# EasyEDA Pro project slimarm_apricot.eprj, schematic Schematic1
Create Date: 2023-05-16; Page Name: P1; Project Name: slimarm_apricot_dev; Schematic Name: Schematic1; Update Date: 2023-05-26; Company: jlywxy; Drawed: jlywxy; Page Size: A4; Part Number: Apricot; Reviewed: jlywxy; Version: V1.0
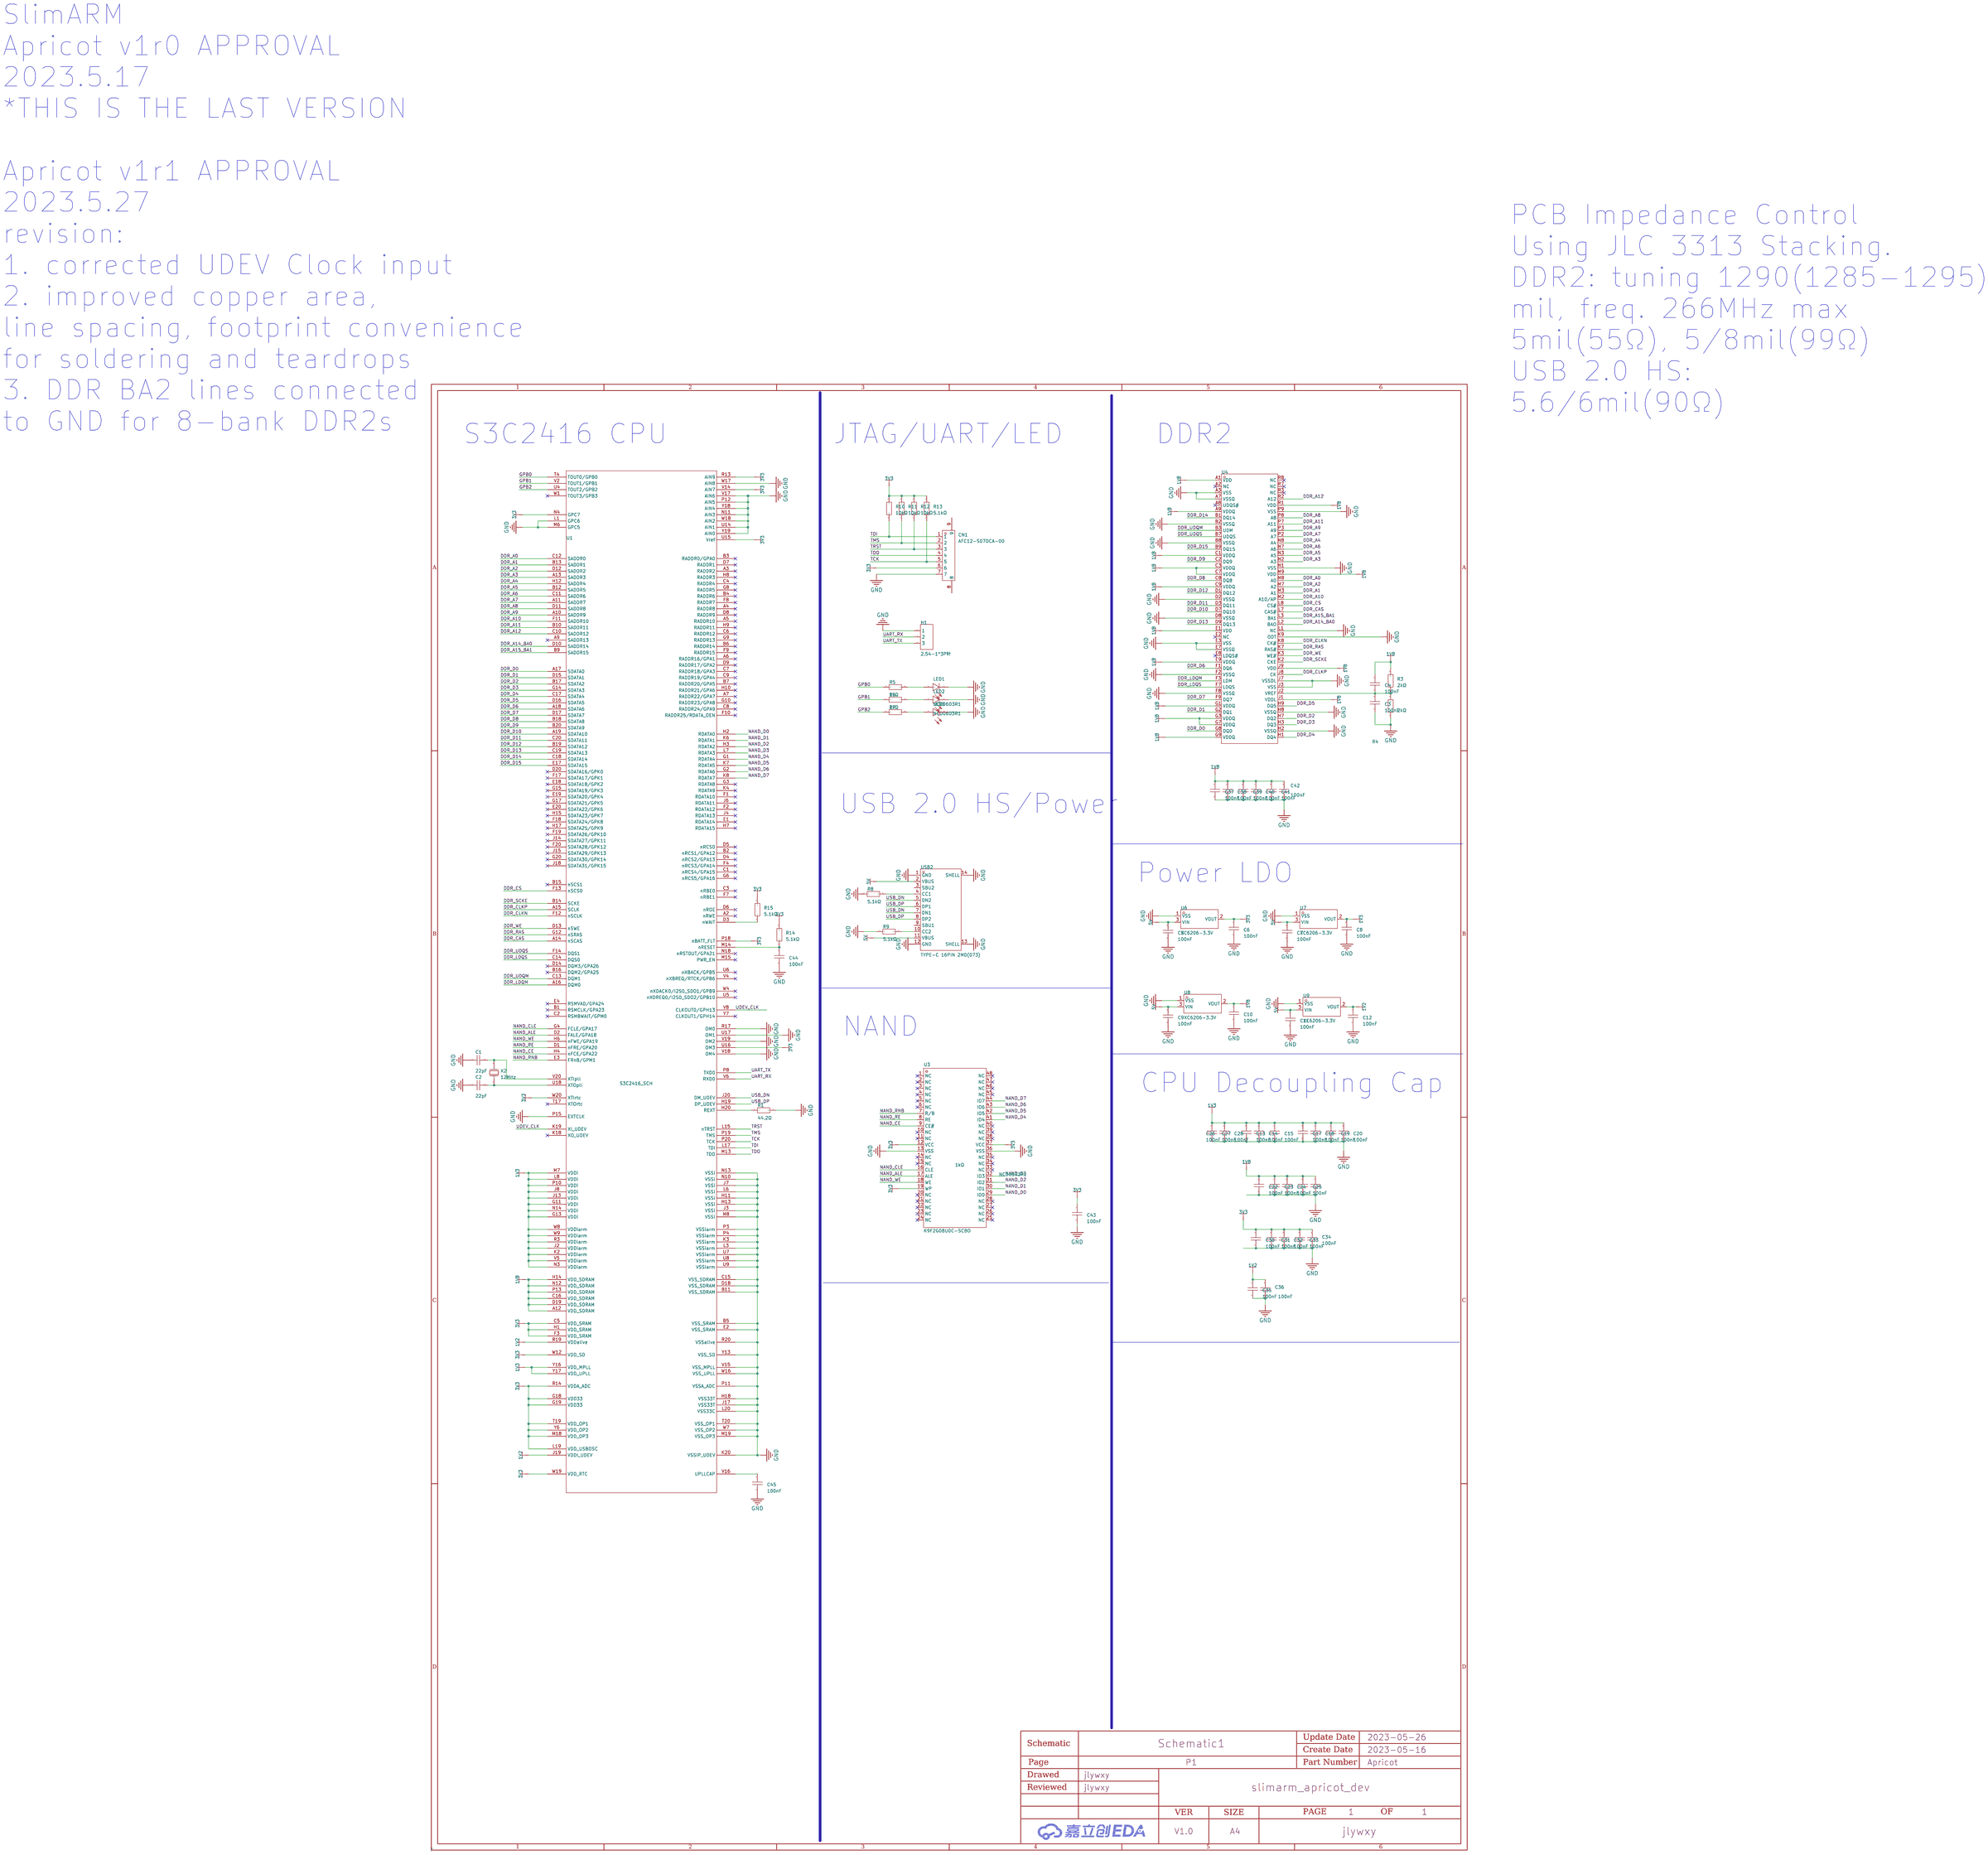
[diagram p0: schematic sheet]

## Parts
C1  22pF  [C0402]
C2  22pF  [C0402]
C3  100nF  [C0402]
C4  100nF  [C0402]
C5  100nF  [C0402]
C6  100nF  [C0402]
C7  100nF  [C0402]
C8  100nF  [C0402]
C9  100nF  [C0402]
C10  100nF  [C0402]
C11  100nF  [C0402]
C12  100nF  [C0402]
C13  100nF  [C0402]
C14  100nF  [C0402]
C15  100nF  [C0402]
C17  100nF  [C0402]
C18  100nF  [C0402]
C19  100nF  [C0402]
C20  100nF  [C0402]
C22  100nF  [C0402]
C23  100nF  [C0402]
C24  100nF  [C0402]
C25  100nF  [C0402]
C26  100nF  [C0402]
C27  100nF  [C0402]
C28  100nF  [C0402]
C30  100nF  [C0402]
C31  100nF  [C0402]
C32  100nF  [C0402]
C33  100nF  [C0402]
C34  100nF  [C0402]
C35  100nF  [C0402]
C36  100nF  [C0402]
C37  100nF  [C0402]
C38  100nF  [C0402]
C39  100nF  [C0402]
C40  100nF  [C0402]
C41  100nF  [C0402]
C42  100nF  [C0402]
C43  100nF  [C0402]
C44  100nF  [C0402]
C45  100nF  [C0402]
CN1  AFC12-S07DCA-00  [CONN-SMD_AFC12-S07DCA-00]
H1  2.54-1*3P针  [HDR-TH_3P-P2.54-V-M-1]
LED1  NCD0603R1  [LED0603-RD_RED]
LED2  NCD0603R1  [LED0603-RD_RED]
LED3  NCD0603R1  [LED0603-RD_RED]
R1  44.2Ω  [R0603]
R3  2kΩ  [R0603]
R4  2kΩ  [R0603]
R5  1kΩ  [R0603]
R6  1kΩ  [R0603]
R7  1kΩ  [R0603]
R8  5.1kΩ  [R0402]
R9  5.1kΩ  [R0402]
R10  10kΩ  [R0402]
R11  10kΩ  [R0402]
R12  10kΩ  [R0402]
R13  5.1kΩ  [R0402]
R14  5.1kΩ  [R0402]
R15  5.1kΩ  [R0402]
U1  S3C2416_SCH  [S3C2416-XH40]
U3  K9F2G08U0C-SCBO  [TSOP-48_L12.0-W18.4-P0.50-LS20.0-BL]
U4  NT5TU32M16FG-AC  [VFBGA-84_L7.5-W12.2-P0.80-TL_NANYA_NT5TU32M16FG]
U6  XC6206-3.3V  [SSOT-3_L2.9-W1.6-P0.95-LS2.8-BR]
U7  XC6206-3.3V  [SSOT-3_L2.9-W1.6-P0.95-LS2.8-BR]
U8  XC6206-3.3V  [SSOT-3_L2.9-W1.6-P0.95-LS2.8-BR]
U9  XC6206-3.3V  [SSOT-3_L2.9-W1.6-P0.95-LS2.8-BR]
USB2  TYPE-C 16PIN 2MD(073)  [USB-C-SMD_TYPE-C-6PIN-2MD-073]
X2  12MHz  [CRYSTAL-SMD_L5.0-W3.2]

## Library data of the parts
C1-C15 C17-C20 C22-C28 C30-C45 = CC0402JRNPO9BN220: 容值:22pF;精度:±5%;额定电压:50V;材质(温度系数):NP0;; LCSC Part Name: 22pF ±5% 50V; Supplier Part: C106203; Manufacturer: YAGEO(国巨); Supplier Footprint: 0402; JLCPCB Part Class: Extended Part; Datasheet: https://atta.szlcsc.com/upload/public/pdf/source/20170425/1493115775511.pdf; Supplier: LCSC; Tolerance: ±5%; Voltage Rated: 50V; Temperature Coefficient: NP0
CN1 = AFC12-S07DCA-00: 参考系列:-;间距:1.25mm;插针结构:1x7P;排数:1;每排PIN数:7;行距:-;公母:公型插针;安装方式:卧贴;额定电流:1A;工作温度范围:-20℃~+85℃;; LCSC Part Name: 1.25mm 1x7P 卧贴; Supplier Part: C561394; Manufacturer: JS(钜硕电子); Supplier Footprint: SMD,P=1.25mm; JLCPCB Part Class: Extended Part; Datasheet: https://atta.szlcsc.com/upload/public/pdf/source/20191211/C466543_1944CC24B799268ED4D26E9C7CC66BEC.pdf; Supplier: LCSC; Pitch: 1.25mm; Pins Structure: 1x7P; Number of Rows: 1; Number of PINs Per Row: 7; Gender: 公型插针; Mounting Style: 卧贴; Current Rating (Max): 1A; Operating Temperature Range: -20℃~+85℃
H1 = 2.54-1*3P针: 排数:单排;总PIN位数:3;间距:2.54mm;插针结构:1x3P;行距:-;安装类型:直插;圆针/方针:方针;额定电流:3A;额定电压:-;配合针长度:-;塑高:-;端接针长度:-;触头材质:-;触头镀层:-;工作温度范围:-40℃~+105℃;颜色:黑色;; LCSC Part Name: 2.54mm 1x3P 直插 方针; Supplier Part: C49257; Manufacturer: BOOMELE(博穆精密); Supplier Footprint: 插件,P=2.54mm; JLCPCB Part Class: Extended Part; Datasheet: https://atta.szlcsc.com/upload/public/pdf/source/20221018/3E9408392E35E6F57A28985E5F7BF5C9.pdf; Supplier: LCSC; Number of Rows: 单排; Number of Pins: 3; Pitch: 2.54mm; Pin Structure: 1x3P; Mounting Type: 直插; Circluar Pins/Square Pins: 方针; Current Rating (Max): 3A; Operating Temperature Range: -40℃~+105℃; Color: 黑色
LED1-LED3 = NCD0603R1_C84263: 发光颜色:红灯;; LCSC Part Name: 红灯; Supplier Part: C84263; Manufacturer: 国星光电; Supplier Footprint: 0603; JLCPCB Part Class: Extended Part; Datasheet: https://atta.szlcsc.com/upload/public/pdf/source/20200820/C84263_DABC6A75E58F576973B407FDBA283D60.pdf; Supplier: LCSC; Emitted Color: 红灯
R1 R3 R4 = RCT0244R2FLF: 阻值:44.2Ω;精度:±1%;功率:62.5mW;; LCSC Part Name: 44.2Ω ±1% 62.5mW; Supplier Part: C173939; Manufacturer: HKR; Supplier Footprint: 0402; JLCPCB Part Class: Extended Part; Datasheet: https://atta.szlcsc.com/upload/public/pdf/source/20180228/C173939_15197985674981376031.pdf; Supplier: LCSC; Tolerance: ±1%; Power(Watts): 62.5mW
R5-R7 = 0603WAF1001T5E: 电阻类型:厚膜电阻;阻值:1kΩ;精度:±1%;功率:100mW;; LCSC Part Name: 1kΩ ±1% 100mW; Supplier Part: C21190; Manufacturer: UNI-ROYAL(厚声); Supplier Footprint: 0603; JLCPCB Part Class: Basic Part; Datasheet: https://atta.szlcsc.com/upload/public/pdf/source/20200306/C422600_1E6D84923E4A46A82E41ADD87F860B5C.pdf; Supplier: LCSC; Type: 厚膜电阻; Tolerance: ±1%; Power(Watts): 100mW; Temperature Coefficient: ±100ppm/℃; Overload Voltage (Max): 75V; Operating Temperature Range: -55℃~+155℃
R8-R15 = 0402WGF5101TCE: 电阻类型:厚膜电阻;阻值:5.1kΩ;精度:±1%;功率:62.5mW;; LCSC Part Name: 5.1kΩ ±1% 62.5mW; Supplier Part: C25905; Manufacturer: UNI-ROYAL(厚声); Supplier Footprint: 0402; JLCPCB Part Class: Basic Part; Datasheet: https://atta.szlcsc.com/upload/public/pdf/source/20200306/C422600_1E6D84923E4A46A82E41ADD87F860B5C.pdf; Supplier: LCSC; Type: 厚膜电阻; Tolerance: ±1%; Power(Watts): 62.5mW; Temperature Coefficient: ±100ppm/℃; Overload Voltage (Max): 50V; Operating Temperature Range: -55℃~+155℃
U1 = S3C2416_SCH
U3 = K9F2G08U0C-SCBO: 存储器构架(格式):FLASH;存储器接口类型:Parallel;存储器容量:2Gb (256M x 8);存储器类型:Non-Volatile;; Supplier Part: C40316; Supplier Footprint: TSOP-48; JLCPCB Part Class: Extended Part; Datasheet: https://atta.szlcsc.com/upload/public/pdf/source/20150922/1457707410697.pdf; Supplier: LCSC
U4 = NT5TU32M16FG-AC: Supplier Part: C2903553; Manufacturer: Nanya(南亚科技); Supplier Footprint: BGA; JLCPCB Part Class: Extended Part; Supplier: LCSC
U6-U9 = XC6206-3.3V: 输出类型:固定;输出极性:正;最大输入电压:6V;输出电压:3.3V;输出电流:250mA;; Supplier Part: C2891841; Manufacturer: YONGYUTAI(永裕泰); Supplier Footprint: SOT-23-3L; JLCPCB Part Class: Extended Part; Datasheet: https://atta.szlcsc.com/upload/public/pdf/source/20210901/DE3C77F0CE73FFE8F7C655BE9B94CB06.pdf; Supplier: LCSC; Output Type: 固定; Output Polarity: 正; Number of Outputs: 1; Maximum Input Voltage: 6V; Output Voltage: 3.3V; Output Current: 250mA; Operating Temperature: -40℃~+85℃
USB2 = TYPE-C 16PIN 2MD(073): 连接器类型:Type-C;标准:-;公母:母座;触点数量:16;端口数量:1;安装方式:卧贴;额定电流 - 电源:5A;工作温度范围:-25℃~+85℃;; LCSC Part Name: TYPE-C母座 16P 4脚插件带定位柱 不锈钢外壳 2次模顶; Supplier Part: C2765186; Manufacturer: SHOU HAN(首韩); Supplier Footprint: SMD; JLCPCB Part Class: Extended Part; Datasheet: https://atta.szlcsc.com/upload/public/pdf/source/20211123/39B17C16241EAC15C5E277BDA434118E.pdf; Supplier: LCSC; Connector Type: Type-C; Gender: 母座; Number of Contacts: 16; Number of Ports: 1; Mounting Style: 卧贴; Current Rating - Power (Max): 5A; Operating Temperature Range: -25℃~+85℃
X2 = X50328MSB2GI: 频率:8MHz;频率公差:±10ppm;负载电容:20pF;; LCSC Part Name: 8MHz ±10ppm 20pF YSX530GA; Supplier Part: C115962; Manufacturer: YXC(扬兴晶振); Supplier Footprint: SMD5032-2P; JLCPCB Part Class: Basic Part; Datasheet: https://atta.szlcsc.com/upload/public/pdf/source/20230220/0EBFFB9D6D8CE6A211407822BBB6C516.pdf; Supplier: LCSC; Crystal Type: 贴片无源晶振; Frequency Tolerance: ±10ppm; Frequency Stability: ±50ppm; Load Capacitance: 20pF; Operating Temperature: -40℃~+85℃

## Nets
1V2: C12.1 C35.1 C36.1 U1.J19(VDDI_UDEV) U1.R19(VDDalive) U9.2(VOUT)
1V3: C8.1 C13.1 C14.1 C15.1 C17.1 C18.1 C19.1 C20.1 C27.1 C28.1 U1.G11(VDDi) U1.G13(VDDi) U1.J2(VDDiarm) U1.J8(VDDi) U1.J13(VDDi) U1.K2(VDDiarm) U1.L8(VDDi) U1.M7(VDDi) U1.N3(VDDiarm) U1.N14(VDDi) U1.P10(VDDi) U1.R3(VDDiarm) U1.V5(VDDiarm) U1.W8(VDDiarm) U1.W9(VDDiarm) U1.Y16(VDD_MPLL) U1.Y17(VDD_UPLL) U7.2(VOUT)
1V8: C4.1 C10.1 C22.1 C23.1 C24.1 C25.1 C26.1 C37.1 C38.1 C39.1 C40.1 C41.1 C42.1 R3.2 U1.A12(VDD_SDRAM) U1.C16(VDD_SDRAM) U1.D19(VDD_SDRAM) U1.H14(VDD_SDRAM) U1.N12(VDD_SDRAM) U1.P13(VDD_SDRAM) U4.A1(VDD) U4.A9(VDDQ) U4.C1(VDDQ) U4.C3(VDDQ) U4.C7(VDDQ) U4.C9(VDDQ) U4.E1(VDD) U4.E9(VDDQ) U4.G1(VDDQ) U4.G3(VDDQ) U4.G7(VDDQ) U4.G9(VDDQ) U4.J1(VDDL) U4.J9(VDD) U4.M9(VDD) U4.R1(VDD) U8.2(VOUT)
3V3: C6.1 C30.1 C31.1 C32.1 C33.1 C34.1 C43.1 CN1.6 R10.2 R11.2 R12.2 R13.2 R14.2 R15.2 U1.C5(VDD_SRAM) U1.F3(VDD_SRAM) U1.G18(VDD33) U1.G19(VDD33) U1.H1(VDD_SRAM) U1.L19(VDD_USBOSC) U1.M18(VDD_OP3) U1.N4(GPC7) U1.P18(nBATT_FLT) U1.R13(AIN9) U1.R14(VDDA_ADC) U1.T19(VDD_OP1) U1.U15(Vref) U1.U16(OM3) U1.V14(AIN7) U1.W12(VDD_SD) U1.W19(VDD_RTC) U1.W20(XTIrtc) U1.Y6(VDD_OP2) U3.12(VCC) U3.19(WP) U3.37(VCC) U6.2(VOUT)
5V: C5.1 C7.1 C9.1 C11.1 U6.3(VIN) U7.3(VIN) U8.3(VIN) U9.3(VIN) USB2.2(VBUS) USB2.11(VBUS)
GND: C1.1 C2.1 C3.1 C5.2 C6.2 C7.2 C8.2 C9.2 C10.2 C11.2 C12.2 C13.2 C14.2 C15.2 C17.2 C18.2 C19.2 C20.2 C22.2 C23.2 C24.2 C25.2 C26.2 C27.2 C28.2 C30.2 C31.2 C32.2 C33.2 C34.2 C35.2 C36.2 C37.2 C38.2 C39.2 C40.2 C41.2 C42.2 C43.2 C44.2 C45.2 CN1.7 H1.1 LED1.1(K) LED2.1(K) LED3.1(K) R1.2 R4.1 R8.1 R9.1 U1.B5(VSS_SRAM) U1.B11(VSS_SDRAM) U1.C15(VSS_SDRAM) U1.D18(VSS_SDRAM) U1.E2(VSS_SRAM) U1.H11(VSSi) U1.H13(VSSi) U1.H18(VSS33T) U1.J3(VSSi) U1.J7(VSSi) U1.J17(VSS33T) U1.K3(VSSiarm) U1.K20(VSSIP_UDEV) U1.L1(GPC6) U1.L3(VSSiarm) U1.L6(VSSi) U1.L20(VSS33C) U1.M6(GPC5) U1.M8(VSSi) U1.M19(VSS_OP3) U1.N10(VSSi) U1.N11(AIN3) U1.N13(VSSi) U1.P3(VSSiarm) U1.P4(VSSiarm) U1.P11(VSSA_ADC) U1.P12(AIN5) U1.P15(EXTCLK) U1.R17(OM0) U1.R20(VSSalive) U1.T20(VSS_OP1) U1.U7(VSSiarm) U1.U8(VSSiarm) U1.U9(VSSiarm) U1.U14(AIN1) U1.U17(OM1) U1.V15(VSS_MPLL) U1.V17(AIN6) U1.V18(OM4) U1.V19(OM2) U1.W7(VSS_OP2) U1.W16(VSS_UPLL) U1.W17(AIN8) U1.W18(AIN2) U1.Y13(VSS_SD) U1.Y18(AIN4) U1.Y19(AIN0) U3.13(VSS) U3.36(VSS) U4.A3(VSS) U4.A7(VSSQ) U4.B2(VSSQ) U4.B8(VSSQ) U4.D2(VSSQ) U4.D8(VSSQ) U4.E3(VSS) U4.E7(VSSQ) U4.F2(VSSQ) U4.F8(VSSQ) U4.H2(VSSQ) U4.H8(VSSQ) U4.J3(VSS) U4.J7(VSSDL) U4.K9(ODT) U4.L1(NC) U4.N1(VSS) U4.P9(VSS) U6.1(VSS) U7.1(VSS) U8.1(VSS) U9.1(VSS) USB2.1(GND) USB2.12(GND) USB2.13(SHELL) USB2.14(SHELL)
DDR_A0: U1.C12(SADDR0) U4.M8(A0)
DDR_A1: U1.B13(SADDR1) U4.M3(A1)
DDR_A2: U1.D12(SADDR2) U4.M7(A2)
DDR_A3: U1.A13(SADDR3) U4.N2(A3)
DDR_A4: U1.H12(SADDR4) U4.N8(A4)
DDR_A5: U1.B12(SADDR5) U4.N3(A5)
DDR_A6: U1.C11(SADDR6) U4.N7(A6)
DDR_A7: U1.A11(SADDR7) U4.P2(A7)
DDR_A8: U1.D11(SADDR8) U4.P8(A8)
DDR_A9: U1.A10(SADDR9) U4.P3(A9)
DDR_A10: U1.F11(SADDR10) U4.M2(A10/AP)
DDR_A11: U1.B10(SADDR11) U4.P7(A11)
DDR_A12: U1.C10(SADDR12) U4.R2(A12)
DDR_A14_BA0: U1.D10(SADDR14) U4.L2(BAO)
DDR_A15_BA1: U1.B9(SADDR15) U4.L3(BA1)
DDR_CAS: U1.A14(nSCAS) U4.L7(CAS#)
DDR_CLKN: U1.F12(nSCLK) U4.K8(CK#)
DDR_CLKP: U1.A15(SCLK) U4.J8(CK)
DDR_CS: U1.F13(nSCS0) U4.L8(CS#)
DDR_D0: U1.A17(SDATA0) U4.G8(DQ0)
DDR_D1: U1.D15(SDATA1) U4.G2(DQ1)
DDR_D2: U1.B17(SDATA2) U4.H7(DQ2)
DDR_D3: U1.G14(SDATA3) U4.H3(DQ3)
DDR_D4: U1.C17(SDATA4) U4.H1(DQ4)
DDR_D5: U1.D16(SDATA5) U4.H9(DQ5)
DDR_D6: U1.A18(SDATA6) U4.F1(DQ6)
DDR_D7: U1.D17(SDATA7) U4.F9(DQ7)
DDR_D8: U1.B18(SDATA8) U4.C8(DQ8)
DDR_D9: U1.B20(SDATA9) U4.C2(DQ9)
DDR_D10: U1.A19(SDATA10) U4.D7(DQ10)
DDR_D11: U1.C20(SDATA11) U4.D3(DQ11)
DDR_D12: U1.B19(SDATA12) U4.D1(DQ12)
DDR_D13: U1.C19(SDATA13) U4.D9(DQ13)
DDR_D14: U1.C18(SDATA14) U4.B1(DQ14)
DDR_D15: U1.E17(SDATA15) U4.B9(DQ15)
DDR_LDQM: U1.A16(DQM0) U4.F3(LDM)
DDR_LDQS: U1.C14(DQS0) U4.F7(LDQS)
DDR_RAS: U1.G12(nSRAS) U4.K7(RAS#)
DDR_SCKE: U1.B14(SCKE) U4.K2(CKE)
DDR_UDQM: U1.C13(DQM1) U4.B3(UDM)
DDR_UDQS: U1.F14(DQS1) U4.B7(UDQS)
DDR_WE: U1.D13(nSWE) U4.K3(WE#)
GPB0: R5.1 U1.T4(TOUT0/GPB0)
GPB1: R6.1 U1.V2(TOUT1/GPB1)
GPB2: R7.1 U1.U4(TOUT2/GPB2)
NAND_ALE: U1.D2(FALE/GPA18) U3.17(ALE)
NAND_CE: U1.H4(nFCE/GPA22) U3.9(CE#)
NAND_CLE: U1.G4(FCLE/GPA17) U3.16(CLE)
NAND_D0: U1.H2(RDATA0) U3.29(IO0)
NAND_D1: U1.K6(RDATA1) U3.30(IO1)
NAND_D2: U1.H3(RDATA2) U3.31(IO2)
NAND_D3: U1.L7(RDATA3) U3.32(IO3)
NAND_D4: U1.G1(RDATA4) U3.41(IO4)
NAND_D5: U1.K7(RDATA5) U3.42(IO5)
NAND_D6: U1.G2(RDATA6) U3.43(IO6)
NAND_D7: U1.K8(RDATA7) U3.44(IO7)
NAND_RE: U1.D1(nFRE/GPA20) U3.8(RE)
NAND_RNB: U1.E3(FRnB/GPM1) U3.7(R/B)
NAND_WE: U1.H6(nFWE/GPA19) U3.18(WE)
TCK: CN1.5 R13.1 U1.P20(TCK)
TDI: CN1.1 R10.1 U1.L17(TDI)
TDO: CN1.4 U1.M13(TDO)
TMS: CN1.2 R11.1 U1.P19(TMS)
TRST: CN1.3 R12.1 U1.L15(nTRST)
UART_RX: H1.2 U1.V6(RXD0)
UART_TX: H1.3 U1.P8(TXD0)
UDEV_CLK: U1.K19(XI_UDEV) U1.V8(CLKOUT0/GPH13)
USB_DN: U1.J20(DM_UDEV) USB2.5(DN2) USB2.7(DN1)
USB_DP: U1.H19(DP_UDEV) USB2.6(DP1) USB2.8(DP2)
$1N6077: C2.2 U1.U18(XTOpll) X2.1(OSC1)
$1N8508: R1.1 U1.H20(REXT)
$1N8781: C3.2 C4.2 R3.1 R4.2 U4.J2(VREF)
$1N10948: LED1.2(A) R5.2
$1N10951: LED2.2(A) R6.2
$1N10954: LED3.2(A) R7.2
$1N14109: R8.2 USB2.4(CC1)
$1N14112: R9.2 USB2.10(CC2)
$1N17987: C44.1 R14.1 U1.M14(nRESET)
$1N18037: R15.1 U1.D3(nWAIT)
$1N18211: C45.1 U1.V16(UPLLCAP)
$1N30853: C1.2 U1.V20(XTIpll) X2.2(OSC2)

Not connected (* = marked no-connect by the designer): CN1 8 9; U1 A2(nRWE)* A3(RADDR2)* A4(RADDR8)* A5(RADDR10)* A6(RADDR16/GPA1)* A7(RADDR22/GPA7)* A9(SADDR13)* B1(RSMCLK/GPA23)* B2(nRCS1/GPA12)* B3(RADDR0/GPA0)* B4(RADDR6)* B6(RADDR14)* B7(RADDR20/GPA5)* B15(nSCS1)* B16(DQM2/GPA25)* C1(nRCS4/GPA15)* C2(RSMBWAIT/GPM0)* C3(nRBE0)* C4(RADDR4)* C6(RADDR12)* C7(RADDR18/GPA3)* C8(RADDR24/GPA9)* C9(RADDR19/GPA4)* D4(nRCS2/GPA13)* D5(nRCS0)* D6(nROE)* D7(RADDR1)* D8(RADDR9)* D9(RADDR17/GPA2)* D14(DQM3/GPA26)* D20(SDATA16/GPK0)* E1(RDATA14)* E4(RSMVAD/GPA24)* E18(SDATA18/GPK2)* E19(SDATA20/GPK4)* E20(SDATA22/GPK6)* F1(RDATA10)* F2(RDATA12)* F4(nRCS3/GPA14)* F7(nRBE1)* F8(RADDR7)* F9(RADDR15)* F10(RADDR25/RDATA_OEN)* F17(SDATA17/GPK1)* F18(SDATA24/GPK8)* F19(SDATA26/GPK10)* F20(SDATA28/GPK12)* G3(RDATA8)* G6(nRCS5/GPA16)* G8(RADDR5)* G9(RADDR13)* G10(RADDR23/GPA8)* G15(SDATA19/GPK3)* G17(SDATA21/GPK5)* G20(SDATA30/GPK14)* H7(RDATA15)* H8(RADDR3)* H9(RADDR11)* H10(RADDR21/GPA6)* H15(SDATA23/GPK7)* H17(SDATA25/GPK9)* J4(RDATA13)* J6(RDATA11)* J14(SDATA27/GPK11)* J15(SDATA29/GPK13)* J18(SDATA31/GPK15)* K4(RDATA9)* K18(XO_UDEV)* M15(PWR_EN)* N18(nRSTOUT/GPA21)* T17(XTOrtc)* U5(nXDREQ0/I2S0_SDO2/GPB10)* U6(nXBACK/GPB5)* V4(nXBREQ/RTCK/GPB6)* W1(TOUT3/GPB3)* W4(nXDACK0/I2S0_SDO1/GPB9)* Y7(CLKOUT1/GPH14)*; U3 1(NC)* 2(NC)* 3(NC)* 4(NC)* 5(NC)* 6(NC)* 10(NC)* 11(NC)* 14(NC)* 15(NC)* 20(NC)* 21(NC)* 22(NC)* 23(NC)* 24(NC)* 25(NC)* 26(NC)* 27(NC)* 28(NC)* 33(NC)* 34(NC)* 35(NC)* 38(NC)* 39(NC)* 40(NC)* 45(NC)* 46(NC)* 47(NC)* 48(NC)*; U4 A2(NC)* A8(UDQS#)* E2(NC)* E8(LDQS#)* R3(NC)* R7(NC)* R8(NC)*; USB2 3(SBU2) 9(SBU1)

## Notes on the sheet
- PCB Impedance Control
  Using JLC 3313 Stacking.
  DDR2: tuning 1290(1285-1295)
  mil, freq. 266MHz max
  5mil(55Ω), 5/8mil(99Ω)
  USB 2.0 HS:
  5.6/6mil(90Ω)
- SlimARM
  Apricot v1r0 APPROVAL
  2023.5.17
  *THIS IS THE LAST VERSION
  Apricot v1r1 APPROVAL
  2023.5.27
  revision:
  1. corrected UDEV Clock input
  2. improved copper area,
  line spacing, footprint convenience
  for soldering and teardrops
  3. DDR BA2 lines connected
  to GND for 8-bank DDR2s
- S3C2416 CPU
- JTAG/UART/LED
- DDR2
- USB 2.0 HS/Power
- Power LDO
- NAND
- CPU Decoupling Cap
